# Altium project OpAMP_89C51.PrjPcb
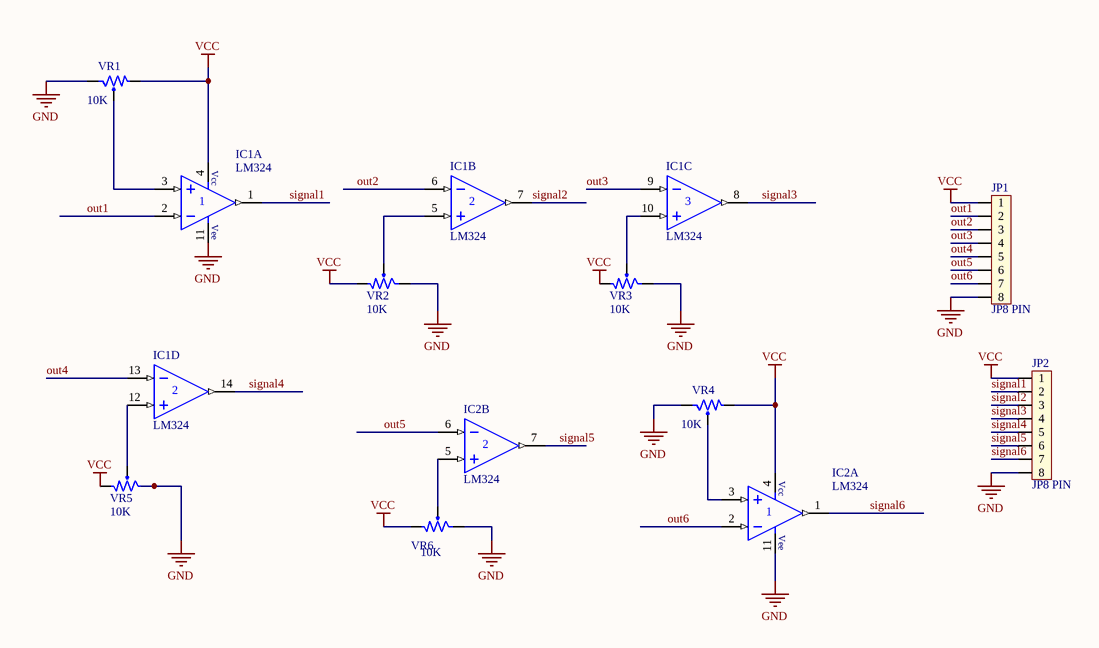
[diagram p0: OpAMP_Sensor.SchDoc]
1 sheet, 10 parts. Net scope: global (net labels, ports and power ports of the same name join across sheets).
Board file: OpAMp.PcbDoc

## Sheet OpAMP_Sensor.SchDoc
size A4

### Parts
IC1  LM324  [DIP14/W0.3]  (parts A,B,C,D of 4)
IC2  LM324  [DIP14/W0.3]  (parts A,B of 4)
JP1  JP8 PIN  [JP8]
JP2  JP8 PIN  [JP8]
VR1  10K  [VR]
VR2  10K  [VR]
VR3  10K  [VR]
VR4  10K  [VR]
VR5  10K  [VR]
VR6  10K  [VR]

### Nets
GND: IC1.11(V-) IC2.11(V-) JP1.8 JP2.8 VR1.3 VR2.3 VR3.3 VR4.3 VR5.3 VR6.3
VCC: IC1.4(V+) IC2.4(V+) JP1.1 JP2.1 VR1.1 VR2.1 VR3.1 VR4.1 VR5.1 VR6.1
out1: IC1.2(IN-) JP1.2
out2: IC1.6(IN-) JP1.3
out3: IC1.9(IN-) JP1.4
out4: IC1.13(IN-) JP1.5
out5: IC2.6(IN-) JP1.6
out6: IC2.2(IN-) JP1.7
signal1: IC1.1(OUT) JP2.2
signal2: IC1.7(OUT) JP2.3
signal3: IC1.8(OUT) JP2.4
signal4: IC1.14(OUT) JP2.5
signal5: IC2.7(OUT) JP2.6
signal6: IC2.1(OUT) JP2.7
NetIC1_3: IC1.3(IN+) VR1.2
NetIC1_5: IC1.5(IN+) VR2.2
NetIC1_10: IC1.10(IN+) VR3.2
NetIC1_12: IC1.12(IN+) VR5.2
NetIC2_3: IC2.3(IN+) VR4.2
NetIC2_5: IC2.5(IN+) VR6.2

### Notes on the sheet
- (in symbol LM324, part A) Vcc; Vee

### Library data of the parts
IC1 IC2 = LM324: Op x 4; Value: LM324
JP1 JP2 = JP8: Value: JP7
VR1-VR6 = VR1: Var Resistor; Value: VR 10K